# EAGLE design OV7725 (EAGLE 9.1.2)
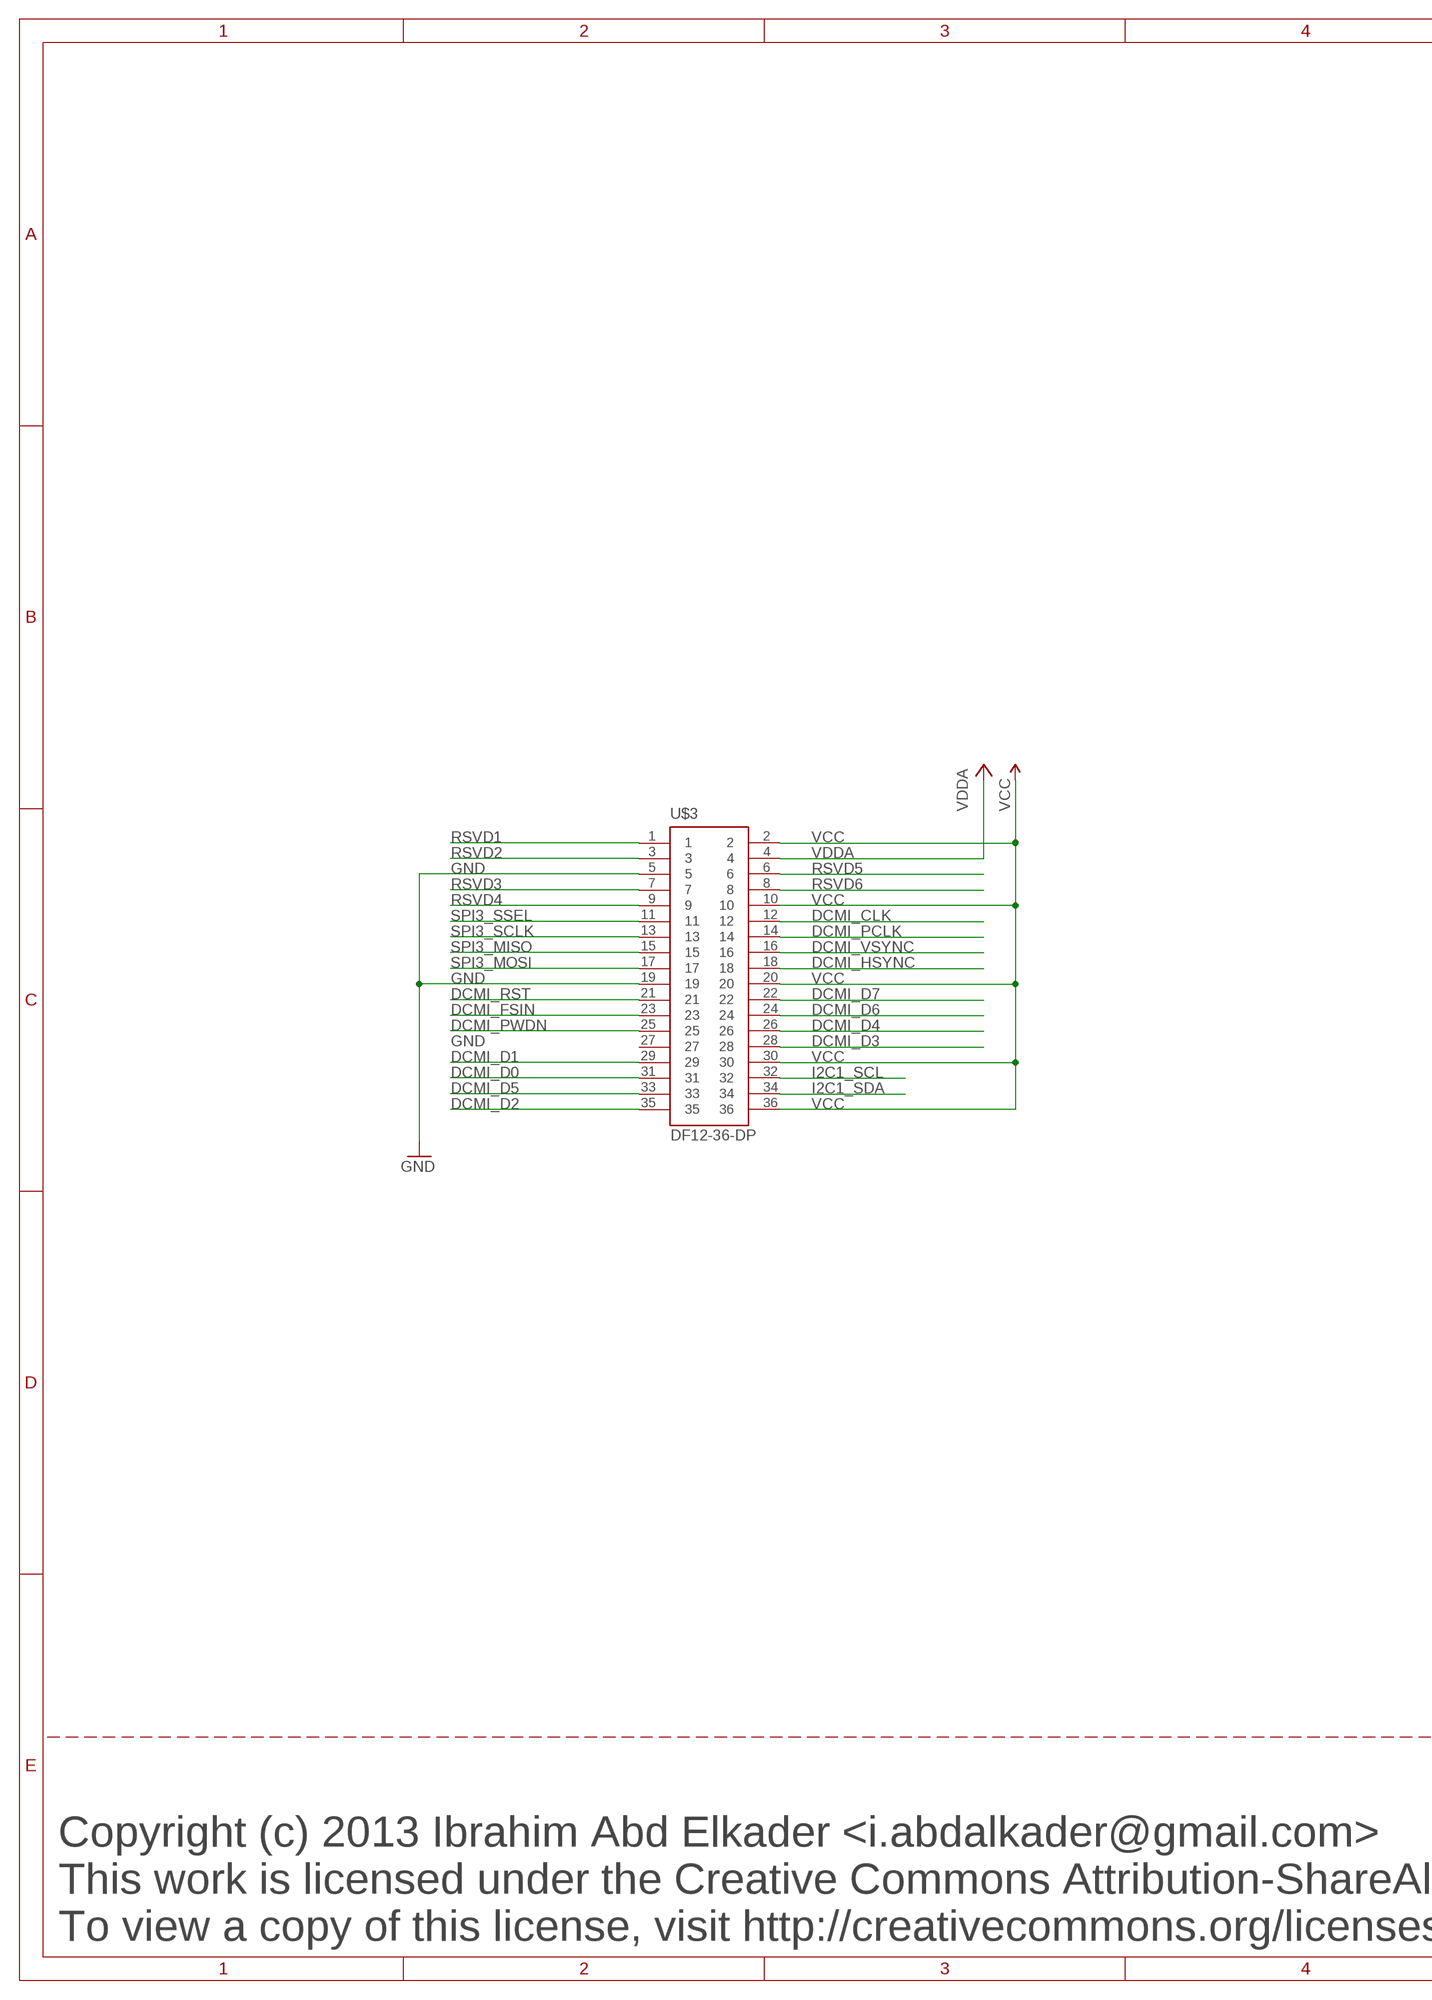
[diagram p0: schematic, sheet 1, part 1 of 2]
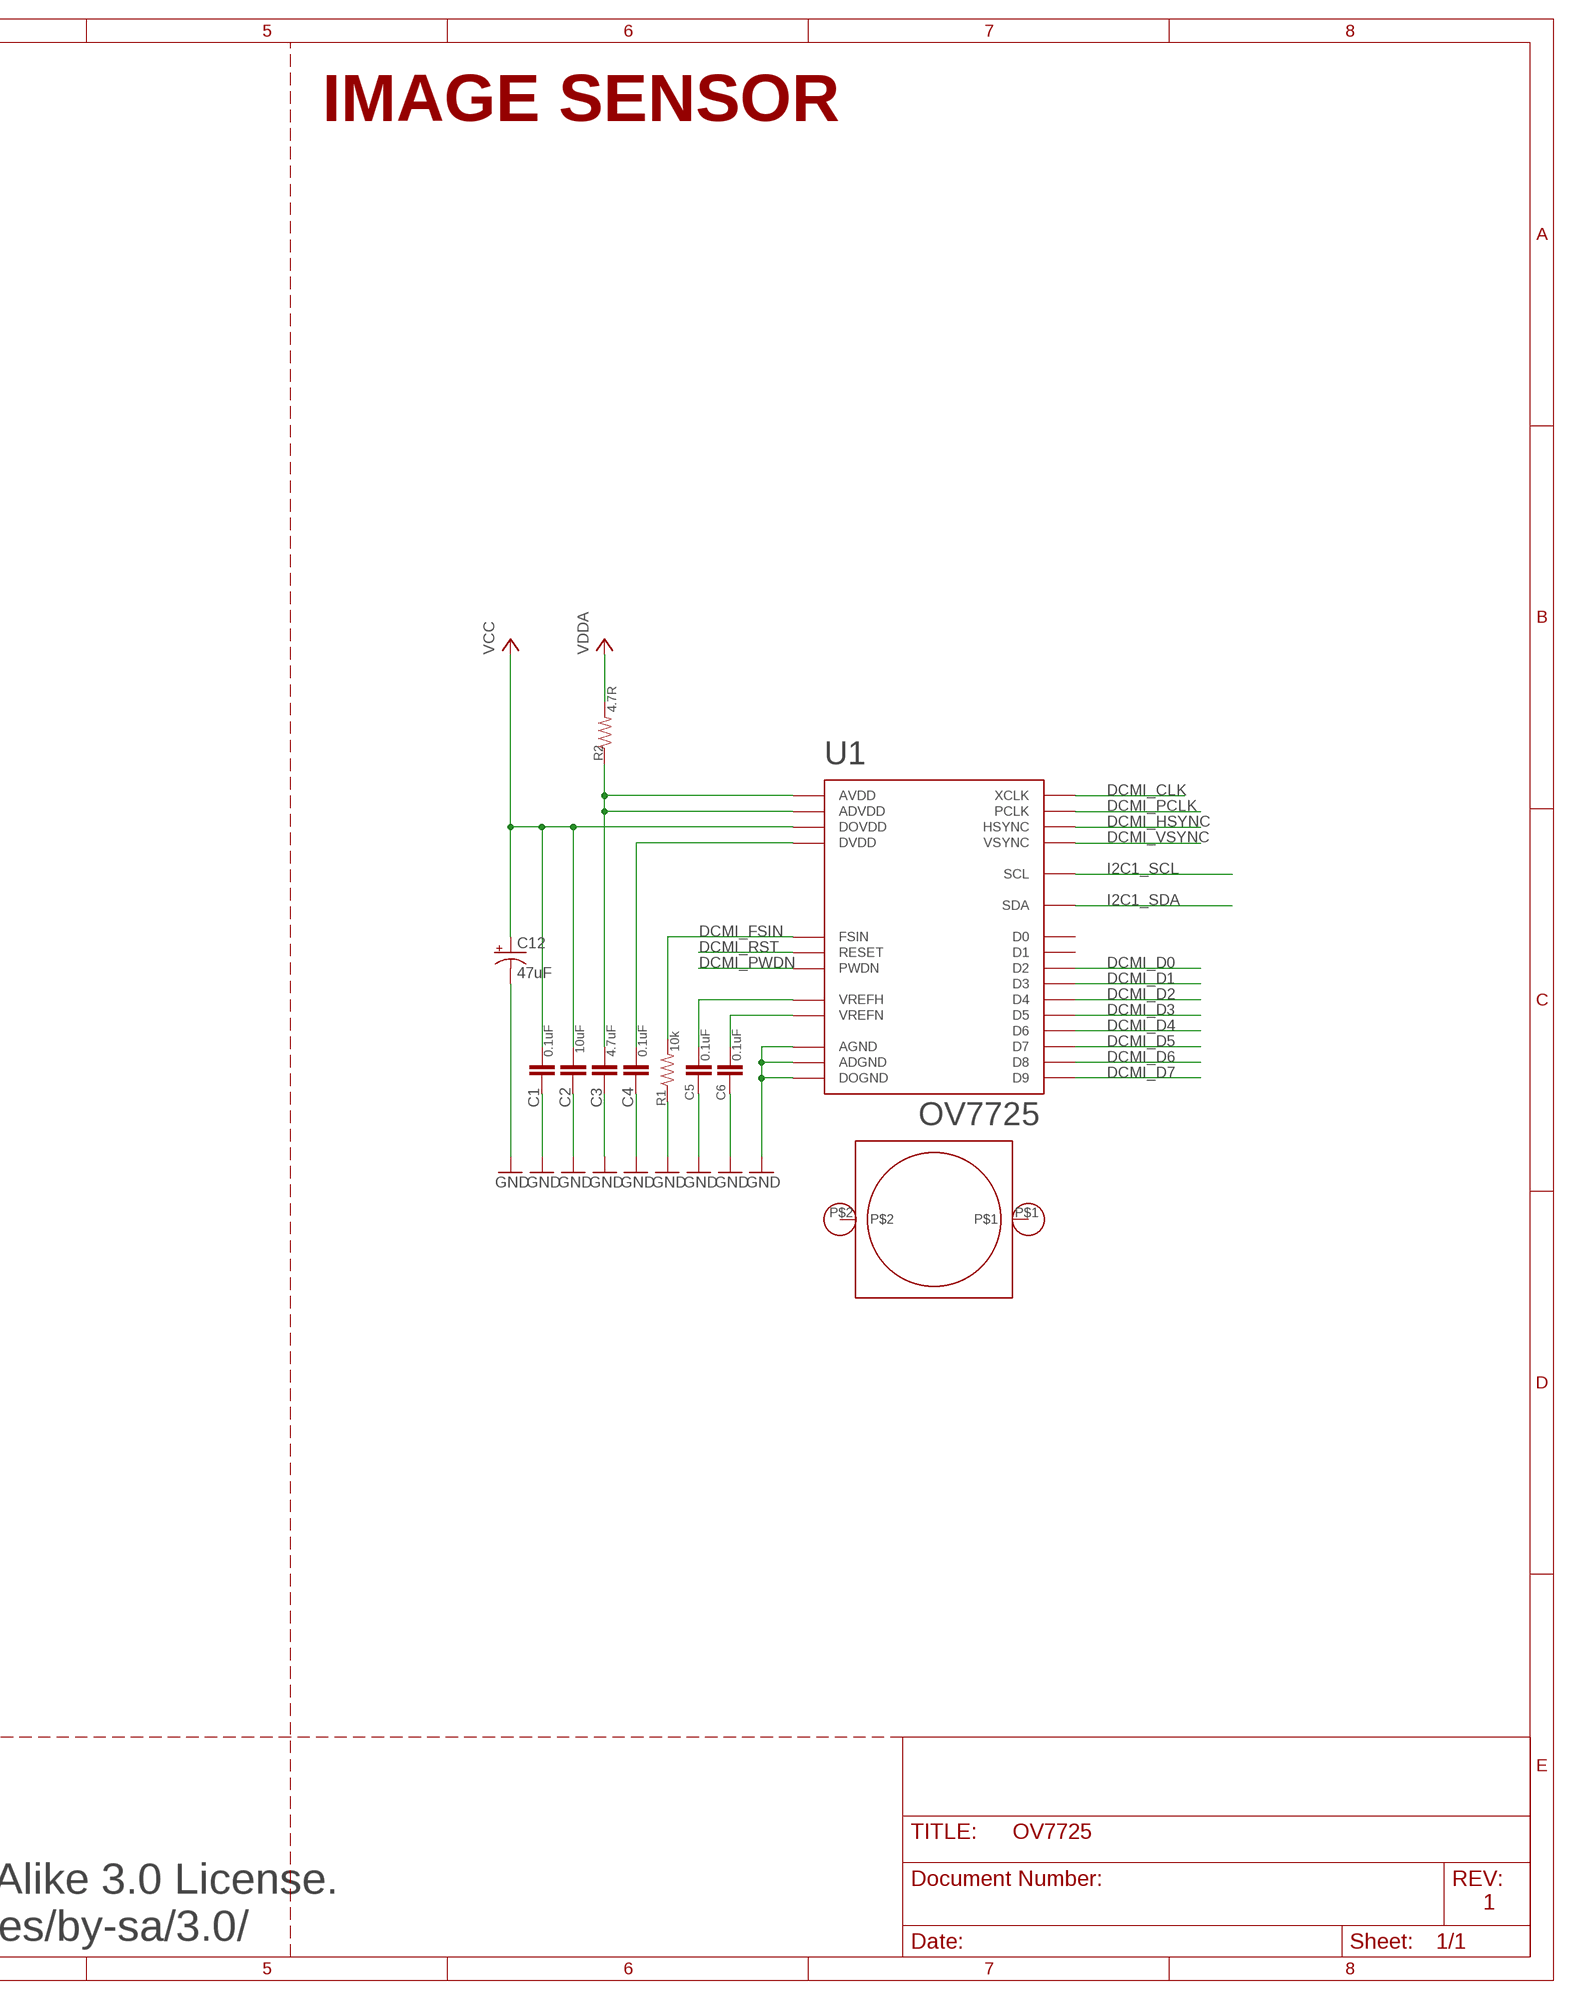
[diagram p1: schematic, sheet 1, part 2 of 2]

## Parts
C1  0.1uF  CAP0603-CAP  [0603-CAP]
C2  10uF  CAP0805  [0805]
C3  4.7uF  CAP0603-CAP  [0603-CAP]
C4  0.1uF  CAP0603-CAP  [0603-CAP]
C5  0.1uF  CAP0603-CAP  [0603-CAP]
C6  0.1uF  CAP0603-CAP  [0603-CAP]
C12  47uF  CAP_POL1206  [EIA3216]
LM1  LENSMOUNT20MM  [LENSMOUNT-20MM]
R1  10k  RESISTOR0603-RES  [0603-RES]
R2  4.7R  RESISTOR0603-RES  [0603-RES]
U1  OV7725  [CSP2-28]
U$3  DF12-36-DP  [DF12-36-DP]

## Nets
AVDD: C3.1 R2.1 U1.A1(ADVDD) U1.B3(AVDD)
DCMI_CLK: U1.F3(XCLK) U$3.12
DCMI_D0: U1.F5(D2) U$3.31
DCMI_D1: U1.F2(D3) U$3.29
DCMI_D2: U1.D6(D4) U$3.35
DCMI_D3: U1.D1(D5) U$3.28
DCMI_D4: U1.E6(D6) U$3.26
DCMI_D5: U1.E1(D7) U$3.33
DCMI_D6: U1.F6(D8) U$3.24
DCMI_D7: U1.F1(D9) U$3.22
DCMI_FSIN: R1.2 U1.A4(FSIN) U$3.23
DCMI_HSYNC: U1.B6(HSYNC) U$3.18
DCMI_PCLK: U1.E4(PCLK) U$3.14
DCMI_PWDN: U1.C1(PWDN) U$3.25
DCMI_RST: U1.A2(RESET) U$3.21
DCMI_VSYNC: U1.C6(VSYNC) U$3.16
GND: C1.2 C2.2 C3.2 C4.2 C5.2 C6.2 C12.C(-) R1.1 U1.B1(ADGND) U1.B4(AGND) U1.F4(DOGND) U$3.5 U$3.19
I2C1_SCL: U1.A5(SCL) U$3.32
I2C1_SDA: U1.B5(SDA) U$3.34
N$1: C5.1 U1.A3(VREFH)
N$3: C6.1 U1.B2(VREFN)
N$15: C4.1 U1.E3(DVDD)
RSVD1: U$3.1
RSVD2: U$3.3
RSVD3: U$3.7
RSVD4: U$3.9
RSVD5: U$3.6
RSVD6: U$3.8
SPI3_MISO: U$3.15
SPI3_MOSI: U$3.17
SPI3_SCLK: U$3.13
SPI3_SSEL: U$3.11
VCC: C1.1 C2.1 C12.A(+) U1.E5(DOVDD) U$3.2 U$3.10 U$3.20 U$3.30 U$3.36
VDDA: R2.2 U$3.4
Unconnected: LM1.P$1 LM1.P$2 U1.A6(D0) U1.E2(D1) U$3.27

## Notes on the sheet
- IMAGE SENSOR
- Copyright (c) 2013 Ibrahim Abd Elkader <i.abdalkader@gmail.com>
- This work is licensed under the Creative Commons Attribution-ShareAlike 3.0 License.
- 1
- To view a copy of this license, visit http://creativecommons.org/licenses/by-sa/3.0/

## Library data of the parts
C1-C6 = sfe:CAP: Capacitor Standard 0603 ceramic capacitor, and 0.1" leaded capacitor.
C12 = sfe:CAP_POL: Capacitor Polarized These are standard SMD and PTH capacitors. Normally 10uF, 47uF, and 100uF in electrolytic and tantalum varieties. Always verify the external diameter of the through hole cap, it varies with capacity, voltage, and manufacturer. The EIA devices should be standard.
LM1 = omnivision:LENSMOUNT
R1 R2 = sfe:RESISTOR: Resistor Basic schematic elements and footprints for 0603, 1206, and PTH resistors.
U1 = omnivision:OV7725
U$3 = DF12:DF12-36-DP

## Board
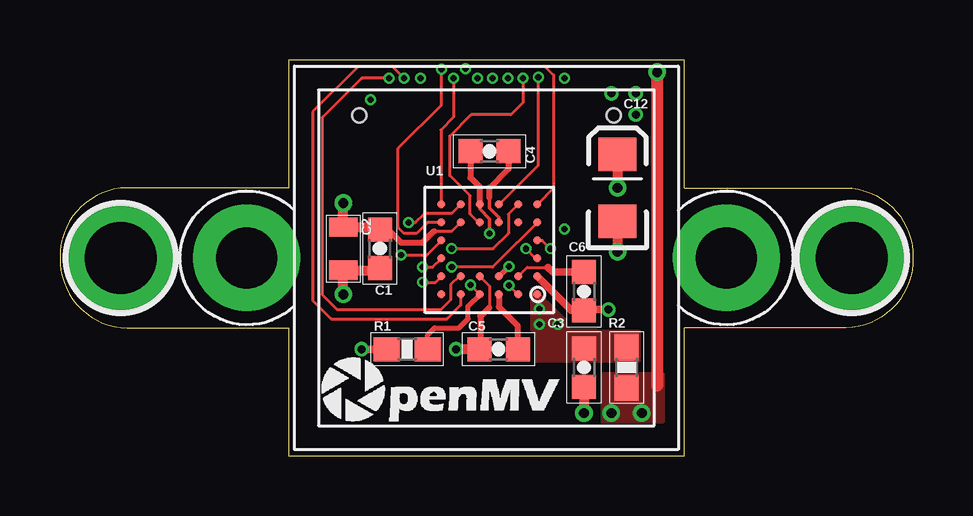
[diagram p2: board, top side]
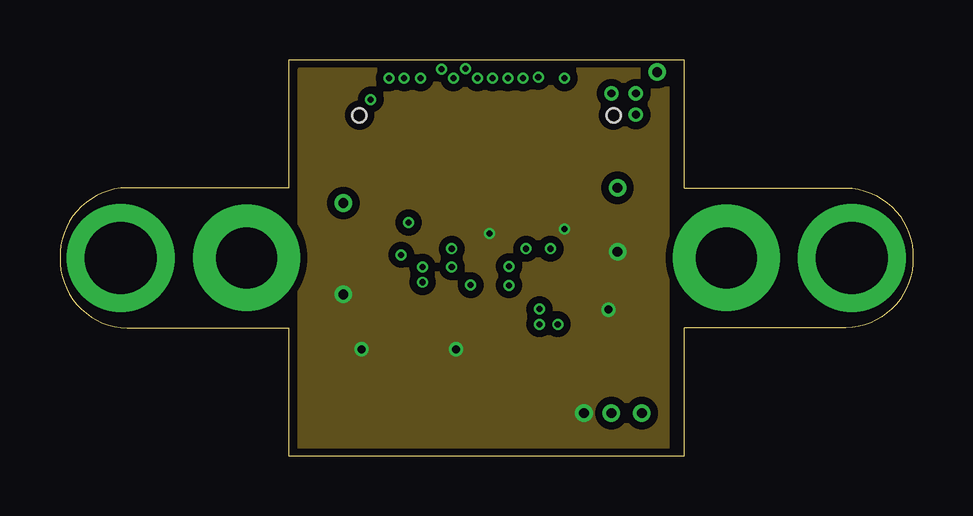
[diagram p3: board, inner layer GND]
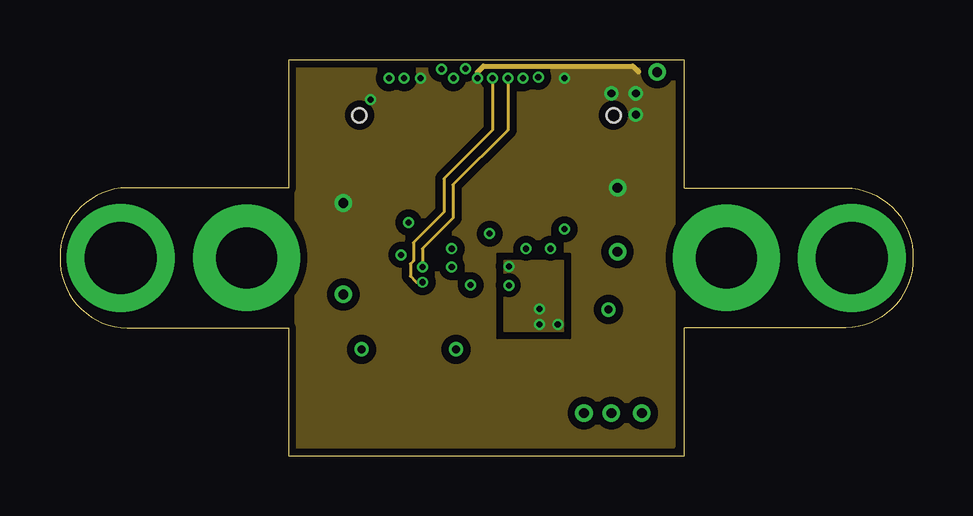
[diagram p4: board, inner layer VCC]
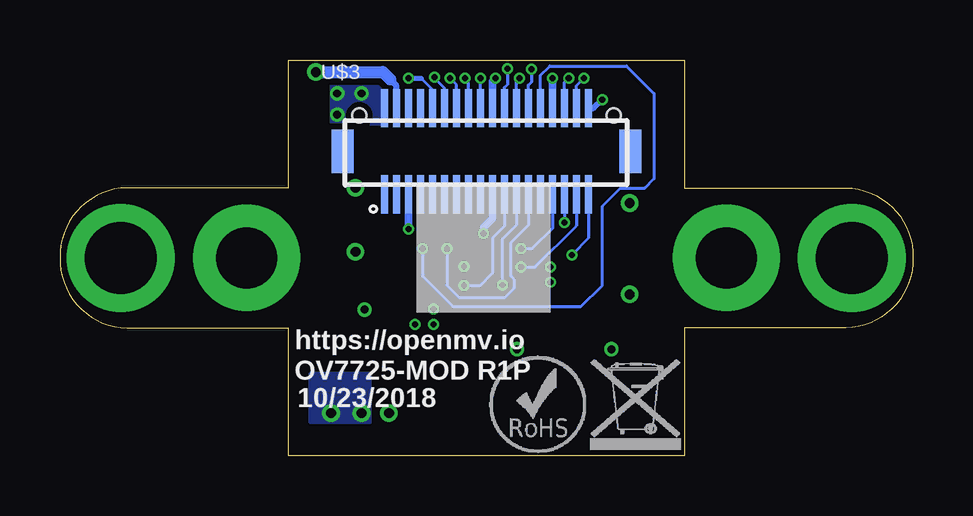
[diagram p5: board, bottom side, seen from below]

Size 35.56 x 16.51 mm. Coordinates in mm from the lower left corner, seen from the top.
Outline: 9.53,16.51 9.53,11.18 2.79,11.18 arc90 0,8.26 arc90 2.79,5.33 9.53,5.33 9.53,0 26.04,0 26.04,5.33 32.77,5.33 arc90 35.56,8.26 arc90 32.77,11.18 26.04,11.18 26.04,16.51 9.53,16.51
Copper layers (1*2+15*16): Top 0.035mm / dielectric 1.5mm / GND 0.035mm / dielectric 0.15mm / VCC 0.035mm / dielectric 0.2mm / Bottom 0.035mm
Design rules "default": minimum track width 5mil, minimum drill 10mil, track to track 5mil, track to pad 5mil, pad to pad 5mil, via to via 5mil, smd to smd 5mil, copper to edge 5mil, drill to drill 10mil, minimum pad ring 10mil, minimum via ring 4mil, stop-mask expansion 2mil, vias tented up to drill 30mil, thermal gap 10mil

### Footprints (pad centres in the part's own frame; a part is rotated, then mirrored left to right if it is on the bottom)
0603-CAP = smd 1 x 1: 1 -0.8,0; 2 0.8,0
0805 = smd 0.8 x 1.2: 1 -0.9,0; 2 0.9,0
EIA3216 = smd 1.4 x 1.6: A 1.4,0; C -1.4,0
LENSMOUNT-20MM = drill 2.54 pad 4.445: P$1 -10,0; P$2 10,0
0603-RES = smd 1.1 x 1: 1 -0.85,0; 2 0.85,0
CSP2-28 = smd 0.34 x 0.34: A1 -2,1.85; A2 -1.2,1.85; A3 -0.4,1.85; A4 0.4,1.85; A5 1.2,1.85; A6 2,1.85; B1 -2,1.1; B2 -1.2,1.1; B3 -0.4,1.1; B4 0.4,1.1; B5 1.2,1.1; B6 2,1.1; C1 -2,0.35; C6 2,0.35; D1 -2,-0.4; D6 2,-0.4; E1 -2,-1.15; E2 -1.2,-1.15; E3 -0.4,-1.15; E4 0.4,-1.15; E5 1.2,-1.15; E6 2,-1.15; F1 -2,-1.9; F2 -1.2,-1.9; F3 -0.4,-1.9; F4 0.4,-1.9; F5 1.2,-1.9; F6 2,-1.9
DF12-36-DP = smd 0.3 x 1.6: 1 -4.25,-1.8; 2 -4.25,1.8; 3 -3.75,-1.8; 4 -3.75,1.8; 5 -3.25,-1.8; 6 -3.25,1.8; 7 -2.75,-1.8; 8 -2.75,1.8; 9 -2.25,-1.8; 10 -2.25,1.8; 11 -1.75,-1.8; 12 -1.75,1.8; 13 -1.25,-1.8; 14 -1.25,1.8; 15 -0.75,-1.8; 16 -0.75,1.8; 17 -0.25,-1.8; 18 -0.25,1.8; 19 0.25,-1.8; 20 0.25,1.8; 21 0.75,-1.8; 22 0.75,1.8; 23 1.25,-1.8; 24 1.25,1.8; 25 1.75,-1.8; 26 1.75,1.8; 27 2.25,-1.8; 28 2.25,1.8; 29 2.75,-1.8; 30 2.75,1.8; 31 3.25,-1.8; 32 3.25,1.8; 33 3.75,-1.8; 34 3.75,1.8; 35 4.25,-1.8; 36 4.25,1.8 | smd 0.9 x 1.8: F1 -6,0; F2 6,0 | hole 0.6: -5.3,1.5; 5.3,1.5

### Placement (x,y rotation side)
C1  13.34,8.64 270 top
C2  11.81,8.64 270 top
C3  21.84,3.68 270 top
C4  17.91,12.7 180 top
C5  18.29,4.45 180 top
C6  21.84,6.86 270 top
C12  23.24,11.18 90 top
LM1  17.78,8.26 0 top
R1  14.48,4.45 0 top
R2  23.62,3.68 270 top
U1  17.9,8.59 180 top
U$1  [WEEE]  13.46,0.25 0 bottom
U$2  [ROHS]  17.65,0.13 0 bottom
U$3  17.78,12.7 0 bottom
U$4  [OMV-LOGO-SMALL]  10.79,1.27 0 top

### Tracks (layer width: path | path; a pad name or v marks a point on that pad's centre or on a via)
AVDD  (via drill 0.25)
  Top 0.127: U1.B3 18.3,7.5
  Top 0.203: U1.B3 v18.72,7.9
  other vias: 19.99,5.49 20.75,5.49 19.99,6.12
  pour Top (isolate 0.254, no thermals): 19.69,6.99 22.35,6.99 22.35,5.21 24.13,5.21 24.13,3.94 19.69,3.94
  pour VCC (isolate 0.254, no thermals): 18.54,8.13 20.95,8.13 20.95,5.21 18.54,5.21
DCMI_CLK  (via drill 0.25)
  Top 0.127: U1.F3 19.94,12.13 v19.94,15.8
  Bottom 0.127: v19.94,15.8 19.94,15.75 19.53,15.34 U$3.12
DCMI_D0  (via drill 0.25)
  Top 0.127: U1.F5 16.7,10.51 | U1.F5 16.7,10.48 | U1.F5 16.7,10.48 16.33,10.11 15.19,10.11 14.81,9.73 v14.53,9.73
  Bottom 0.127: U$3.31 v14.53,9.73
DCMI_D1  (via drill 0.25)
  Top 0.127: U1.F2 18.69,10.08 18.69,9.27 18.06,8.64 v16.33,8.64
  Bottom 0.127: U$3.29 15.03,9.48 15.88,8.64 v16.33,8.64
DCMI_D2  (via drill 0.25)
  Top 0.127: U1.D6 15.29,8.38 v14.22,8.38
  Bottom 0.127: U$3.35 13.53,9.08 v14.22,8.38
DCMI_D3  (via drill 0.25)
  Top 0.127: U1.D1 | U1.D1 19.9,8.98 | U1.D1 20.1,8.99 v20.45,8.64
  Bottom 0.127: U$3.28 15.53,15.86 15.14,16.26 11.94,16.26 10.79,15.11 10.79,11.56 11.18,11.18 12.19,11.18 12.95,10.41 12.95,7.11 13.84,6.22 19.18,6.22 20.45,7.49 v20.45,8.64
DCMI_D4  (via drill 0.25)
  Top 0.127: U1.E6 15.32,9.74 14.86,9.27 14.35,9.27 14.1,9.53 14.1,12.83 15.9,14.63 v15.9,16.13
  Bottom 0.127: v15.9,16.13 15.9,15.59 16.03,15.47 U$3.26
DCMI_D5  (via drill 0.25)
  Top 0.127: U1.E1 18.29,8.13 18.03,7.87 v16.33,7.87
  Bottom 0.127: U$3.33 14.03,9.59 15.75,7.87 v16.33,7.87
DCMI_D6  (via drill 0.25)
  Top 0.127: 15.9,10.52 U1.F6 15.88,10.51 15.88,13.59 16.4,14.12 v16.4,15.75
  Bottom 0.127: U$3.24 16.53,15.62 v16.4,15.75
DCMI_D7  (via drill 0.25)
  Top 0.127: 19.9,10.5 U1.F1 20.57,11.16 20.57,15.88 20.19,16.26 17.02,16.26 v16.9,16.14
  Bottom 0.127: v16.9,16.14 16.9,15.48 17.03,15.36 U$3.22
DCMI_FSIN  (via drill 0.25)
  Top 0.127: U1.A4 17.5,6.76 17.48,6.76 v17.12,7.12
  Top 0.203: R1.2 15.33,5.04 15.62,5.33 16.64,5.33 17.02,5.71 17.02,6.25 U1.A4
  Bottom 0.127: U$3.23 16.53,9.63 17.12,9.04 v17.12,7.12
DCMI_HSYNC  (via drill 0.25)
  Top 0.127: 15.87,7.49 U1.B6 15.65,7.24 v15.11,7.24
  VCC 0.127: v18.03,15.75 18.03,13.59 16,11.56 16,10.16 14.73,8.89 14.73,8.13 14.61,8 14.61,7.49 14.86,7.24 v15.11,7.24
  Bottom 0.127: U$3.18 v18.03,15.74 v18.03,15.75
DCMI_PCLK  (via drill 0.25)
  Top 0.127: U1.E4 17.44,9.74 17.09,10.08 17.09,10.85 16.26,11.68 16.26,13.34 17.14,14.22 18.8,14.22 19.3,14.73 v19.3,15.75
  Bottom 0.127: U$3.14 19.03,15.47 v19.3,15.75
DCMI_PWDN  (via drill 0.25)
  Top 0.127: U1.C1 19.83,8.24 v19.43,8.64
  Bottom 0.127: v19.43,8.64 19.43,7.11 18.92,6.6 17.02,6.6 16.64,6.99 16.64,7.37 16.76,7.49 16.76,8.89 16.03,9.62 U$3.25
DCMI_RST  (via drill 0.25)
  Top 0.127: U1.A2 v18.72,7.11
  Bottom 0.127: U$3.21 17.03,9.59 17.53,9.09 17.53,7.62 18.03,7.11 v18.72,7.11
DCMI_VSYNC  (via drill 0.25)
  Top 0.127: v15.11,7.87 15.54,7.87 U1.C6
  VCC 0.127: v15.11,7.87 15.11,8.64 16.38,9.91 16.38,11.3 18.67,13.59 v18.67,15.75
  Bottom 0.127: U$3.16 18.53,15.61 v18.67,15.75
GND  (via drill 0.25, 0.33, 0.41)
  Top 0.127: U1.B4 17.9,7.09 17.9,6.19
  Top 0.152: U1.F4 17.5,10.29 17.91,9.88 v17.91,9.27
  Top 0.254: 17.9,6.19 17.53,5.81 17.53,4.48 C5.2 | U1.F4 17.5,11.2 17.11,11.6 C4.2
  Top 0.305: R1.1 v12.57,4.45 | U1.B1 21.33,6.06 C6.2 21.88,6.1 v22.86,6.1
  Top 0.406: C12.C v23.24,8.51 | C3.2 v21.84,1.78 | C5.2 v16.51,4.45 | v11.81,6.73 C2.2 13.23,7.74 C1.2
  Bottom 0.305: U$3.5 v21.03,9.45 | U$3.19 17.53,9.9 17.91,9.52 v17.91,9.27
  pour GND (isolate 0.305): 10.03,0.13 10.03,16.13 25.27,16.13 25.27,0.13
I2C1_SCL  (via drill 0.25)
  Top 0.127: v14.35,15.75 13.84,16.26 12.45,16.26 10.54,14.35 10.54,6.48 11.3,5.71 16.13,5.71 16.7,6.29 U1.A5
  Bottom 0.127: U$3.32 14.53,15.57 v14.35,15.75
I2C1_SDA  (via drill 0.25)
  Top 0.127: v13.72,15.75 12.57,15.75 10.92,14.1 10.92,6.73 11.56,6.1 15.88,6.1 16.28,6.5 16.28,7.14 16.63,7.49 U1.B5
  Bottom 0.127: U$3.34 14.03,15.43 v13.72,15.75
N$1
  Top 0.254: U1.A3 18.3,6.21 19.09,5.42 C5.1
N$2  (via drill 3 pad 4.5)
  other vias: 2.54,8.26
N$3
  Top 0.127: U1.B2 19.48,7.86 20.35,7.86
  Top 0.305: C6.1 20.55,7.66 20.35,7.86
N$4  (via drill 3 pad 4.5)
  other vias: 33.02,8.26
N$15
  Top 0.152: 17.9,10.79 17.9,10.34 18.3,9.94 U1.E3
  Top 0.254: C4.1 18.71,11.98 17.9,11.17 17.9,10.79
VCC  (via drill 0.25, 0.33, 0.41)
  Top 0.127: 15.6,9.37 16.34,9.37 U1.E5
  Top 0.254: C1.1 13.68,9.44 14.22,8.89 15.11,8.89 15.6,9.37
  Top 0.406: C12.A v23.24,11.18 | C1.1 13.23,9.54 C2.1 v11.81,10.54
  VCC 0.203: 24.13,16 23.88,16.26 17.65,16.26 17.4,16 v17.4,15.75
  Bottom 0.127: U$3.10 20.03,15.28 20.5,15.75
  Bottom 0.203: v21.03,15.75 20.5,15.75
  Bottom 0.254: U$3.36 13.31,14.5 v12.95,14.86
  Bottom 0.305: U$3.30 v15.03,15.75 | U$3.20 17.53,15.62 v17.4,15.75
  other vias: 24,15.11 22.99,15.11 24,14.22
  pour VCC (isolate 0.305, rank 2): 9.91,0.38 9.91,16.26 25.53,16.26 25.53,0.38
  pour Bottom (isolate 0.254, rank 2, no thermals): 21.97,15.49 24.26,15.49 24.26,13.84 21.97,13.84
VDDA  (via drill 0.41)
  Top 0.508: v24.89,16 24.89,2.92
  Bottom 0.254: U$3.4 21.53,15.43 21.78,15.69
  Bottom 0.508: v24.89,16 22.1,16 21.78,15.69
  other vias: 22.99,1.78 24.26,1.78
  pour Bottom (isolate 0.254, no thermals): 21.08,15.24 21.72,15.24 21.72,13.84 21.08,13.84
  pour Bottom (isolate 0.254, no thermals): 25.15,3.43 25.15,1.4 22.61,1.4 22.61,3.43
  pour Top (isolate 0.254, no thermals): 25.15,3.43 25.15,1.4 22.61,1.4 22.61,3.43

### Text on the board
bPlace: https://openmv.io | OV7725-MOD R1P | 10/23/2018